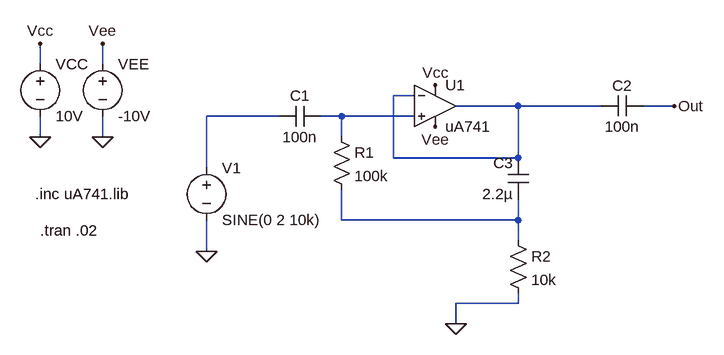
[diagram p0: schematic 2_9c.asc]
2_9c.asc, the LTspice schematic file:
Version 4
SHEET 1 1328 680
WIRE -96 16 -96 -16
WIRE 0 16 0 -16
WIRE 480 64 448 64
WIRE 640 80 544 80
WIRE 768 80 640 80
WIRE 880 80 832 80
WIRE 272 96 160 96
WIRE 368 96 336 96
WIRE 480 96 368 96
WIRE -96 128 -96 96
WIRE 0 128 0 96
WIRE 368 128 368 96
WIRE 448 160 448 64
WIRE 640 160 640 80
WIRE 640 160 448 160
WIRE 160 176 160 96
WIRE 368 256 368 208
WIRE 640 256 640 224
WIRE 640 256 368 256
WIRE 640 288 640 256
WIRE 160 304 160 256
WIRE 640 384 640 368
WIRE 640 384 544 384
WIRE 544 416 544 384
FLAG -96 128 0
FLAG 0 128 0
FLAG -96 -16 Vcc
FLAG 0 -16 Vee
FLAG 512 48 Vcc
FLAG 512 112 Vee
FLAG 880 80 Out
FLAG 160 304 0
FLAG 544 416 0
SYMBOL voltage -96 0 R0
WINDOW 123 0 0 Left 0
WINDOW 39 0 0 Left 0
SYMATTR InstName VCC
SYMATTR Value 10V
SYMBOL voltage 0 0 R0
WINDOW 123 0 0 Left 0
WINDOW 39 0 0 Left 0
SYMATTR InstName VEE
SYMATTR Value -10V
SYMBOL OpAmps\\opamp2 512 16 R0
SYMATTR InstName U1
SYMATTR Value uA741
SYMBOL cap 336 80 R90
WINDOW 0 0 32 VBottom 2
WINDOW 3 32 32 VTop 2
SYMATTR InstName C1
SYMATTR Value 100n
SYMBOL cap 832 64 R90
WINDOW 0 0 32 VBottom 2
WINDOW 3 32 32 VTop 2
SYMATTR InstName C2
SYMATTR Value 100n
SYMBOL cap 656 224 R180
WINDOW 0 24 56 Left 2
WINDOW 3 24 8 Left 2
SYMATTR InstName C3
SYMATTR Value 2.2µ
SYMBOL res 352 112 R0
SYMATTR InstName R1
SYMATTR Value 100k
SYMBOL res 624 272 R0
SYMATTR InstName R2
SYMATTR Value 10k
SYMBOL voltage 160 160 R0
WINDOW 123 0 0 Left 0
WINDOW 39 0 0 Left 0
SYMATTR InstName V1
SYMATTR Value SINE(0 2 10k)
TEXT -104 216 Left 2 !.inc uA741.lib
TEXT -96 272 Left 2 !.tran .02

The netlist it stands for:
* 2_9c.asc
VCC Vcc 0 10V
VEE Vee 0 -10V
XU1 N003 N001 Vcc Vee N001 uA741  ; pins In+ In- V+ V- OUT
C1 N003 N002 100n
C2 Out N001 100n
C3 N004 N001 2.2µ
R1 N003 N004 100k
R2 N004 0 10k
V1 N002 0 SINE(0 2 10k)
.inc uA741.lib
.tran .02
.backanno
.end